# EAGLE design TrinketBlinkM0D (EAGLE 8.4.3)
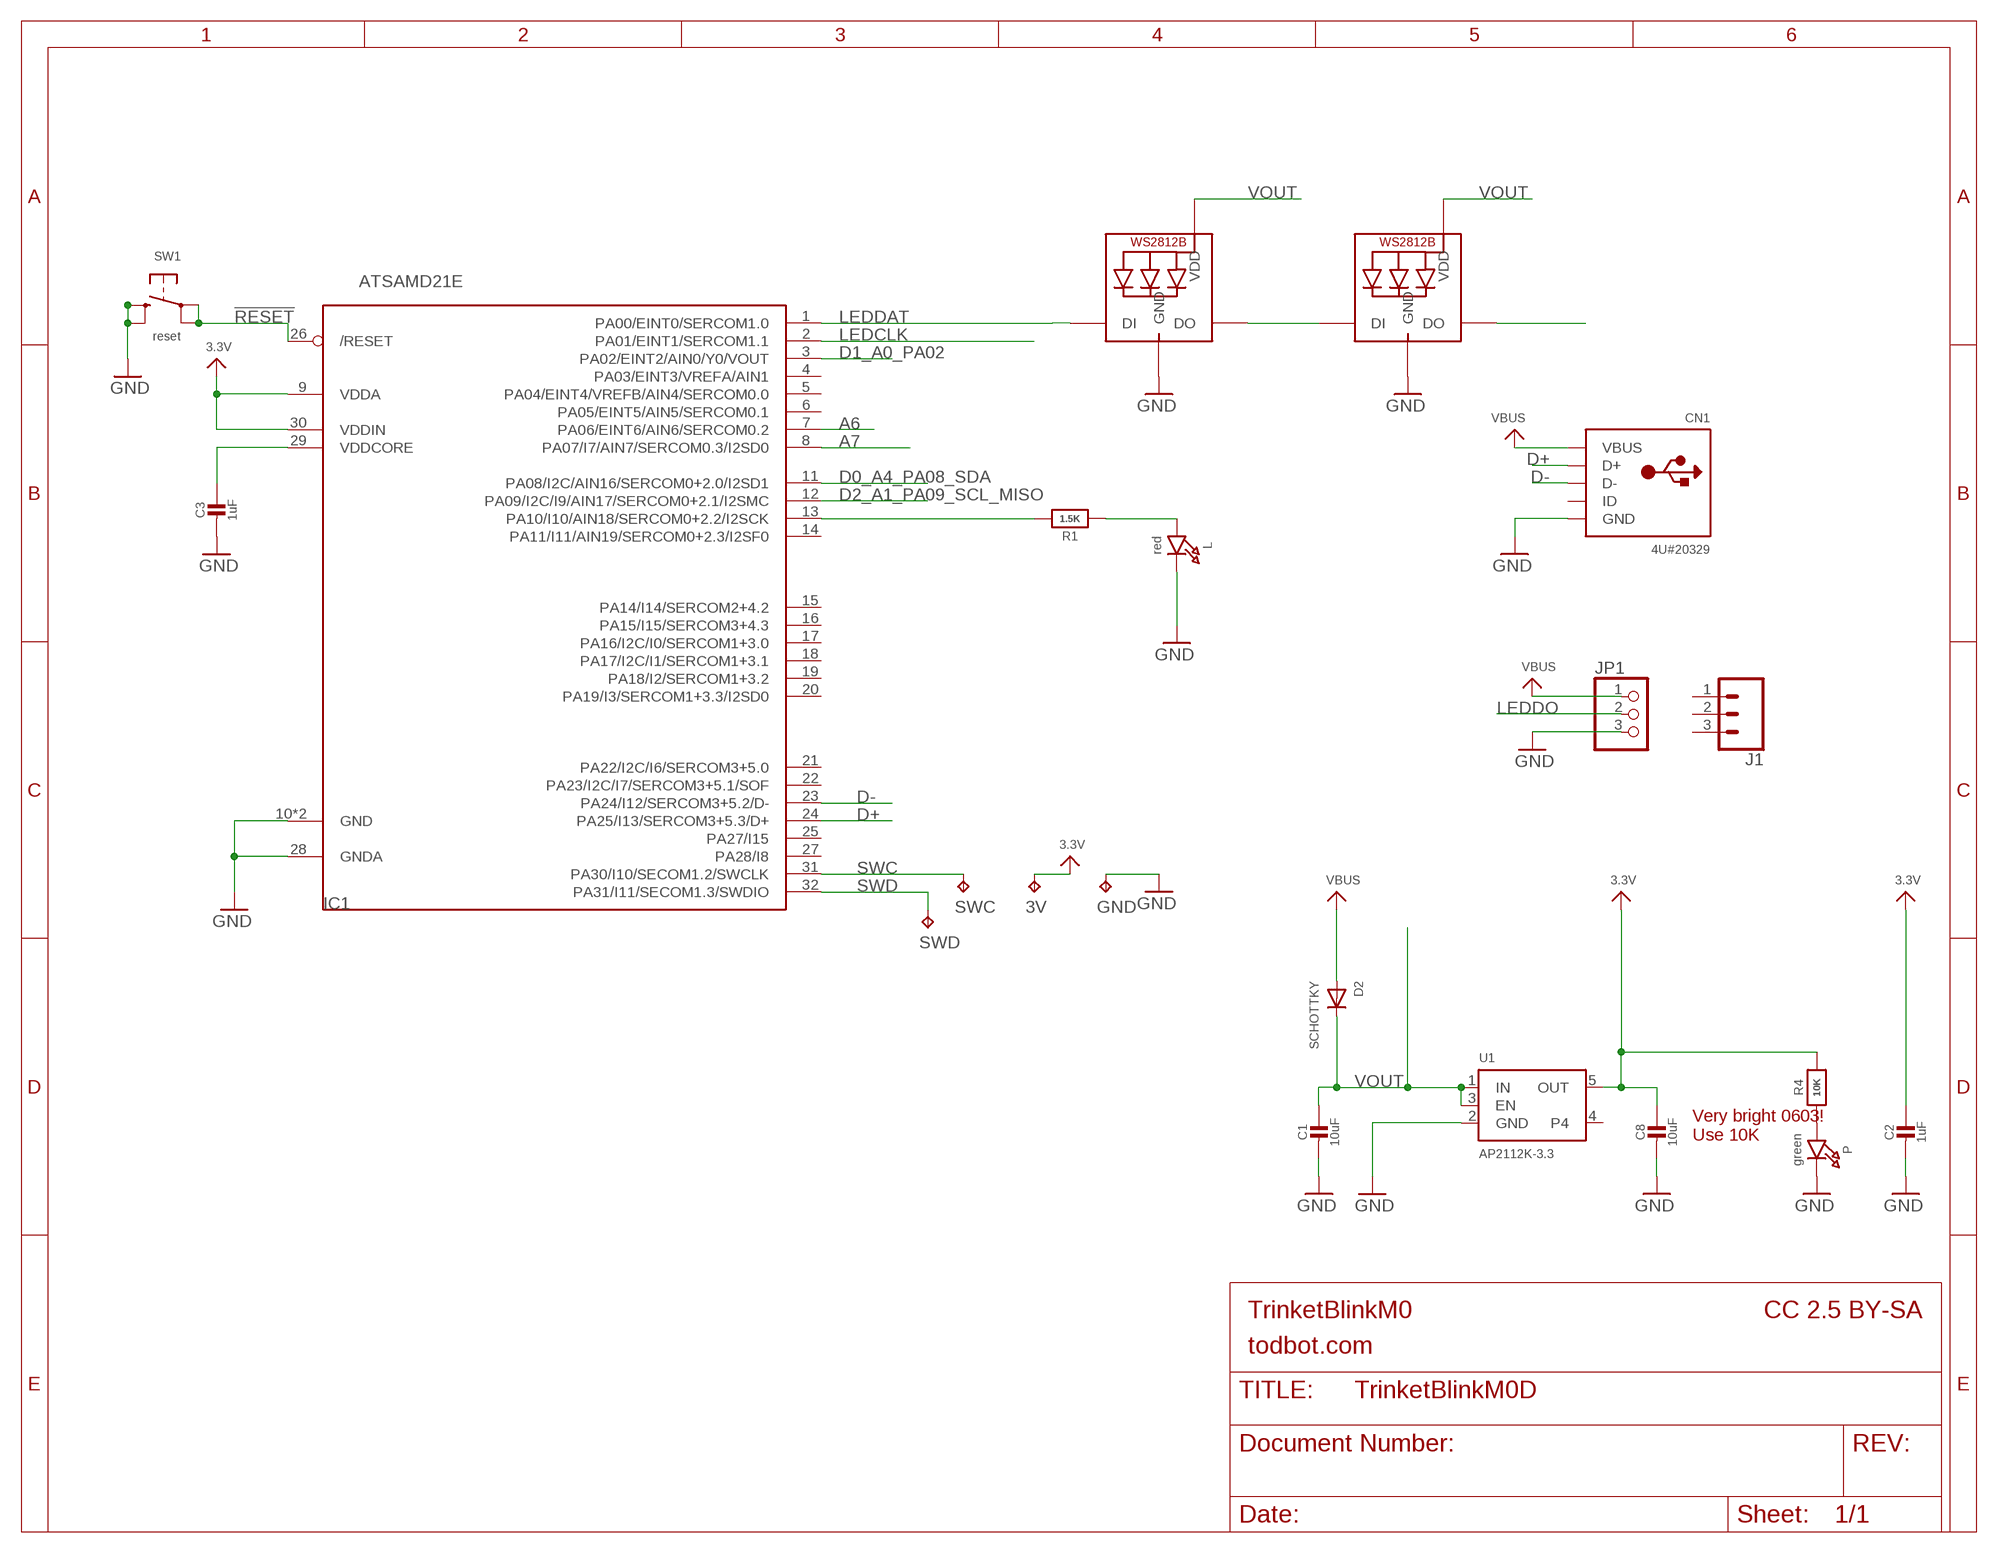
[diagram p0: schematic, sheet 1]

## Parts
3V  TPB1,27  [B1,27]
C1  10uF  CAP_CERAMIC0805-NOOUTLINE  [0805-NO]
C2  1uF  CAP_CERAMIC0603_NO  [0603-NO]
C3  1uF  CAP_CERAMIC0603_NO  [0603-NO]
C8  10uF  CAP_CERAMIC0805-NOOUTLINE  [0805-NO]
CN1  4U#20329  USB_MICRO_20329_V2  [4UCONN_20329_V2]
D2  SCHOTTKY  DIODE_SOD-123FL  [SOD-123FL]
GND  TPB1,27  [B1,27]
IC1  ATSAMD21E  [QFN32_5MM]
J1  CONN_03LONGPADS  [1X03_LONGPADS]
JP1  PINHD-1X3CB  [1X03-CLEANBIG]
L  red  LED0603_NOOUTLINE  [CHIPLED_0603_NOOUTLINE]
LED1  WS2812B_5050N  [WS2812B-NARROW]
LED2  WS2812B_5050N  [WS2812B-NARROW]
P  green  LED0603_NOOUTLINE  [CHIPLED_0603_NOOUTLINE]
R1  1.5K  RESISTOR_0603_NOOUT  [0603-NO]
R4  10K  RESISTOR_0603_NOOUT  [0603-NO]
SW1  reset  SWITCH_TACT_SMT4.6X2.8  [BTN_KMR2_4.6X2.8]
SWC  TPB1,27  [B1,27]
SWD  TPB1,27  [B1,27]
U1  AP2112K-3.3  VREG_SOT23-5  [SOT23-5]

## Nets
3.3V: 3V.TP C2.1 C8.1 IC1.9(VDDA) IC1.30(VDDIN) R4.2 U1.5(OUT)
!RESET: IC1.26(/RESET) SW1.A'(P1) SW1.A(P)
A6: IC1.7(PA06/EINT6/AIN6/SERCOM0.2)
A7: IC1.8(PA07/I7/AIN7/SERCOM0.3/I2SD0)
D0_A4_PA08_SDA: IC1.11(PA08/I2C/AIN16/SERCOM0+2.0/I2SD1)
D1_A0_PA02: IC1.3(PA02/EINT2/AIN0/Y0/VOUT)
D2_A1_PA09_SCL_MISO: IC1.12(PA09/I2C/I9/AIN17/SERCOM0+2.1/I2SMC)
D+: CN1.D+ IC1.24(PA25/I13/SERCOM3+5.3/D+)
D-: CN1.D- IC1.23(PA24/I12/SERCOM3+5.2/D-)
GND: C1.2 C2.2 C3.2 C8.2 CN1.BASE@1(GND) CN1.BASE@2(GND) CN1.GND CN1.SPRT@1(GND) CN1.SPRT@2(GND) CN1.SPRT@3(GND) CN1.SPRT@4(GND) GND.TP IC1.10(GND) IC1.28(GNDA) IC1.33(GND) JP1.3 L.C LED1.3-GND(GND) LED2.3-GND(GND) P.C SW1.B'(S1) SW1.B(S) U1.2(GND)
LEDCLK: IC1.2(PA01/EINT1/SERCOM1.1)
LEDDAT: IC1.1(PA00/EINT0/SERCOM1.0) LED1.4-DIN(DI)
LEDDO: JP1.2 LED2.2-DOUT(DO)
N$1: L.A R1.1
N$2: IC1.13(PA10/I10/AIN18/SERCOM0+2.2/I2SCK) R1.2
N$3: LED1.2-DOUT(DO) LED2.4-DIN(DI)
N$6: P.A R4.1
SWC: IC1.31(PA30/I10/SECOM1.2/SWCLK) SWC.TP
SWD: IC1.32(PA31/I11/SECOM1.3/SWDIO) SWD.TP
VBUS: CN1.VBUS D2.A JP1.1
VDDCORE: C3.1 IC1.29(VDDCORE)
VOUT: C1.1 D2.C LED1.1-VDD(VDD) LED2.1-VDD(VDD) U1.1(IN) U1.3(EN)
Unconnected: CN1.ID IC1.4(PA03/EINT3/VREFA/AIN1) IC1.5(PA04/EINT4/VREFB/AIN4/SERCOM0.0) IC1.6(PA05/EINT5/AIN5/SERCOM0.1) IC1.14(PA11/I11/AIN19/SERCOM0+2.3/I2SF0) IC1.15(PA14/I14/SERCOM2+4.2) IC1.16(PA15/I15/SERCOM3+4.3) IC1.17(PA16/I2C/I0/SERCOM1+3.0) IC1.18(PA17/I2C/I1/SERCOM1+3.1) IC1.19(PA18/I2/SERCOM1+3.2) IC1.20(PA19/I3/SERCOM1+3.3/I2SD0) IC1.21(PA22/I2C/I6/SERCOM3+5.0) IC1.22(PA23/I2C/I7/SERCOM3+5.1/SOF) IC1.25(PA27/I15) IC1.27(PA28/I8) J1.1 J1.2 J1.3 U1.4

## Notes on the sheet
- Very bright 0603!
  Use 10K
- TrinketBlinkM0 | CC 2.5 BY-SA
- todbot.com

## Library data of the parts
3V GND SWC SWD = testpad:TP: Test pad
C1-C3 C8 = microbuilder:CAP_CERAMIC: Ceramic Capacitors For new designs, use the packages preceded by an '_' character since they are more reliable: The following footprints should be used on most boards: _0402 - Standard footprint for regular board layouts _0603 - Standard footprint for regular board layouts _0805 - Standard footprint for regular board layouts _1206 - Standard footprint for regular board layouts For extremely tight-pitch boards where space is at a premium, the following 'micro-pitch' footprints can be used (smaller pads, no silkscreen outline, etc.): _0402MP - Micro-pitch footprint for very dense/compact boards _0603MP - Micro-pitch footprint for very dense/compact boards _0805MP - Micro-pitch footprint for very dense/compact boards _1206MP - Micro-pitch footprint for very dense/compact boards
CN1 = microbuilder:USB: USB Connectors USBMINIB - Surface Mount Female Mini-B USB Connector 4UConnector: 06564
D2 = adafruit:DIODE: Diode SMADIODE - SMA Surface Mount Package 20V 1A Schottky Diode Digikey: 641-1014-6-ND DO-1N4148 - Through Hole Small Current Diode SOD-123 20V 1 A (.5mV Vf) Schottky Diode - Digikey: MBRX120TPMSCT-ND SOD-323 10V 570mA (.38mV Vf, 3ns) Schottky Diode - Digikey: ZLLS410CT-ND SOD-523 30V 30mA Schottky Diode (RB751S-40TE61) - Digikey: RB751S-40TE61CT-ND SOT23-R/W - SOT23 Package (R = Solder Paste/Reflow Ovens, W = Hand-Soldering) BAT54Film 40V 300mA - Digikey: 497-7162-1-ND
IC1 = microbuilder:ATSAMD21E
J1 = SparkFun-Connectors:CONN_03: Multi connection point. Often used as Generic Header-pin footprint for 0.1 inch spaced/style header connections On any of the 0.1 inch spaced packages, you can populate with these: Break Away Headers - Straight <https://www.sparkfun.com/products/116> (PRT-00116) Break Away Male Headers - Right Angle <https://www.sparkfun.com/products/553> (PRT-00553) Female Headers <https://www.sparkfun.com/products/115> (PRT-00115) Break Away Headers - Machine Pin <https://www.sparkfun.com/products/117> (PRT-00117) Break Away Female Headers - Swiss Machine Pin <https://www.sparkfun.com/products/743> (PRT-00743) Stackable Header - 3 Pin (Female, 0.1") <https://www.sparkfun.com/products/13875> (PRT-13875) For SCREWTERMINALS and SPRING TERMINALS visit here: Screw Terimnals on SparkFun.com <https://www.sparkfun.com/search/results?term=Screw+Terminals> (5mm/3.5mm/2.54mm spacing) This device is also useful as a general connection point to wire up your design to another part of your project. Our various solder wires solder well into these plated through hole pads. Hook-Up Wire - Assortment (Stranded, 22 AWG) <https://www.sparkfun.com/products/11375> (PRT-11375) Hook-Up Wire - Assortment (Solid Core, 22 AWG) <https://www.sparkfun.com/products/11367> (PRT-11367) View the entire wire category on our website here <https://www.sparkfun.com/categories/141> Special notes: Molex polarized connector foot print use with SKU : PRT-08232 with associated crimp pins and housings.
JP1 = adafruit:PINHD-1X3: PIN HEADER
L P = microbuilder:LED: LED 0603 - 0603 Surface Mount Package 2mA: Green LED - Low Power (3.9mcd, 2ma, 1.7Vf) - Digikey: 475-2709-2-ND Orange LED - Low Power (9.8mcd, 2ma, 1.8Vf) - Digikey: 475-1194-2-ND Red LED - Low Power (5mcd, 2ma, 1.8Vf) - Digikey: 475-1195-2-ND Yellow LED - Low Power (7mcd, 2ma, 1.8Vf) - Digikey: 475-1196-2-ND 5mA: Blue LED - Low Power (17mcd, 5ma, 2.9Vf) - Digikey: LNJ937W8CRACT-ND 0805 - 0805 Surface Mount Package 2mA: Red LED (8.8mcd, 2mA, 1.8Vf, Clear) - Low Power [Digikey: 475-2510-1-ND] Green LED (5mcd, 2mA, 1.8Vf, Clear) - Low Power [Digikey: 475-2730-1-ND] Yellow LED (11.3mcd, 2mA, 1.8Vf, Clear) - Low Power [Digikey: 475-2555-1-ND] 20mA: Red LED (104mcd, 20mA, Diffused) - LS R976 [Digikey: 475-1278-6-ND] Red LED (12mcd, 20mA, 2.0Vf, Clear) - APT2012EC [Digikey: 754-1128-1-ND] Green LED (15mcd, 20mA, 2.2Vf, Clear) - APT2012GC [Digikey: 754-1131-1-ND] Orange LED (160mcd, 20mA, 2.1Vf, Clear) - APT2012SECK [Digikey: 754-1130-1-ND] 1206 - 1206 Surface Mount Package Green LED (26mcd, 20mA, Diffused) - LG N971 [Digikey: 475-1407-6-ND] Red LED (15mcd, 20mA, Diffused) - LH N974 [Digikey: 475-1416-6-ND] Cree - Cree High-Power Surface Mount LEDs XPEBWT-L1-0000-00D50 - White 111lm 350mA 2.9Vf 6200K 110° XTEAWT-00-0000-00000LEE3 - White 114lm 350mA 2.85Vf 5000K 115° Everlight - Everlight 45-21 Series Surface Mount LEDs 45-21/QK2C-B2832AC2CB2/2T - Warm White 2000mcd 20mA 3.25Vf 3050K 120° 45-21/LK2C-B38452C4CB2/2T - Nuetral White 2000mcd 20mA 3.25Vf 4150K 120° 45-21/LK2C-B50634C6CB2/2T - Cold White 2200mcd 20mA 3.25Vf 5650K 120° PLCC2 Reverse Mount LS T77K-J1L2-1-0-2-R18-Z - Red 11.25mcd 2mA 1.8Vf 630nm 120° LO T77K-L1M2-24-Z - Orange 19.6mcd 2mA 1.8Vf 606nm 120° LY T77K-K2M1-26-Z - Yellow 15.7mcd 2mA 1.8Vf 587nm 120°
LED1 LED2 = adafruit:WS2812B
R1 R4 = microbuilder:RESISTOR: Resistors For new designs, use the packages preceded by an '_' character since they are more reliable: The following footprints should be used on most boards: _0402 - Standard footprint for regular board layouts _0603 - Standard footprint for regular board layouts _0805 - Standard footprint for regular board layouts _1206 - Standard footprint for regular board layouts For extremely tight-pitch boards where space is at a premium, the following 'micro-pitch' footprints can be used (smaller pads, no silkscreen outline, etc.): _0402MP - Micro-pitch footprint for very dense/compact boards _0603MP - Micro-pitch footprint for very dense/compact boards _0805MP - Micro-pitch footprint for very dense/compact boards _1206MP - Micro-pitch footprint for very dense/compact boards
SW1 = microbuilder:SWITCH_TACT_SMT: SMT Tact Switches 6x6mm - Digikey: P12940SCT-ND KMR2 (4.6x2.8mm) - Digikey: 401-1426-1-ND EVQ-PQHB55 - Light Touch, 160GF (4.5x4.5mm) - Digikey: P8090SCT-ND KMT0 - KMT021 NGJ LHS (etc.) IP68/Waterproof - Digikey: CKN10289CT-ND
U1 = microbuilder:VREG_SOT23-5: SOT23-5 Fixed Voltage Regulators Part Current Out V Out V In V Dropout θJA (°C/W) TJ (°C) Digikey Part No. ADP121 150mA 3.3V 3.4-5.5V 0.09V @ 150mA -- -- ADP121-AUJZ33R7CT-ND ADP121 150mA 3.0V 3.1-5.5V 0.09V @ 150mA -- -- ADP121-AUJZ30R7CT-ND ADP122 300mA 3.3V 3.4-5.5V 0.085V @ 300mA -- -- ADP122AUJZ-3.3-R7CT-ND ADP1712 300mA 3.3V 3.5-5.5V 0.17V @ 300mA -- -- ADP1712AUJZ-3.3-R7TR-ND AP7311 (Low Cost) 150mA 3.3V 3.5-6V 0.15V @ 150mA -- -- AP7311-33WG-7DICT-ND LD39015M18R 150mA 1.8V 1.9V-5.5V 0.08V @ 100mA -- -- 497-6977-1-ND LP2985A-33DBVR 150mA 3.3V 3.3-16V 0.28V @ 150mA 206 150 296-18479-1-ND MCP1824T-3302E/OT 300mA 3.3V 3.5V-6V 0.2V @ 300mA -- -- MCP1824T-3302E/OTCT-ND MIC5205-2.5YM5 TR 150mA 2.5V 2.7-16V 0.165V @ 150mA -- -- 576-1257-2-ND MIC5205-3.0YM5 TR 150mA 3.0V 3.2V-16V 0.165V @ 150mA -- -- 576-1258-2-ND MIC5205-3.3YM5 TR 150mA 3.3V 3.5V-16V 0.165V @ 150mA -- -- 576-1259-2-ND TPS780330220 150mA 3.3V+2.2V 3.6-5.5V 250mV Max -- -- 296-23332-1-ND TDA3663/N1,135 100mA 3.3V 3.5-45V 0.18V @ 50mA -- -- 568-5343-1-ND Max operating temp can be calculated using θJA, TJ (max junction temperature), and power in watts. Set the "Maximum Ambient Temperature" until it reaches TJ ("Max Junction Temperature"), which is the absolute limit for safe use of the regulator: Heat Sink Temperature Calculator <http://www.daycounter.com/Calculators/Heat-Sink-Temperature-Calculator.phtml> For example, With 12V source into a 3.3V LP2985 and a 30mA load, we are dissipating (12V-3.3V) * 0.03A = 0.261W. With a θJA of 206 °C/W, a TJ of 150°C, and 261mW we can safely use the chip without a heat sink up to 75°C (=147.1°C Junction Temperature).

## Net classes
1 power: width 0.305 mm

## Board
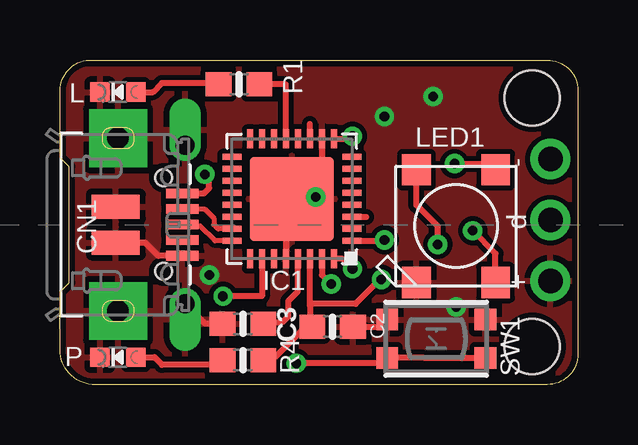
[diagram p1: board, top side]
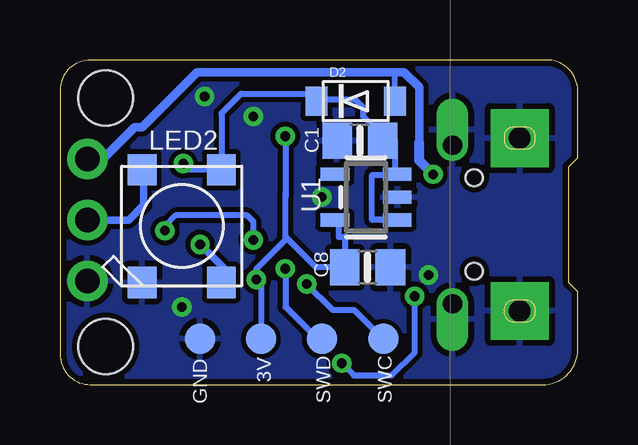
[diagram p2: board, bottom side, seen from below]

Size 21.6 x 13.53 mm. Coordinates in mm from the lower left corner, seen from the top.
Outline: 1.21,13.53 19.25,13.53 20.33,13.53 arc-90 21.6,12.26 21.6,1.27 arc-90 20.33,0 19.88,0 1.34,0 arc-90 0.01,1.59 0.01,3.87 0.39,4.25 0.39,9.08 0.01,9.46 0.01,12.13 arc-90 1.21,13.53
Copper layers (1*16): Top 0.035mm / dielectric 1.5mm / Bottom 0.035mm
Design rules "adafruit *": minimum track width 8mil, minimum drill 15.5mil, track to track 8mil, track to pad 8mil, pad to pad 8mil, via to via 8mil, smd to smd 8mil, copper to edge 10mil, drill to drill 8mil, minimum pad ring 10mil, minimum via ring 8mil, stop-mask expansion 2mil, vias tented up to drill 20mil, thermal gap 10mil
Holes 2.29 mm at 19.69,1.59 19.69,11.94

### Footprints (pad centres in the part's own frame; a part is rotated, then mirrored left to right if it is on the bottom)
B1,27 = smd 1.27 x 1.27: TP 0,0
0805-NO = smd 1.24 x 1.5: 1 -0.95,0; 2 0.95,0
0603-NO = smd 1.075 x 1: 1 -0.85,0; 2 0.85,0
4UCONN_20329_V2 = smd 1 x 2: BASE@1 -0.75,-2; BASE@2 0.75,-2 | smd 0.4 x 1.35: D+ 0,0.775; D- -0.65,0.775; GND 1.3,0.775; ID 0.65,0.775; VBUS -1.3,0.775 | drill 0.8 pad 1.143 offset: SPRT@1 -3.3,0.9; SPRT@2 3.3,0.9 | drill 0.9 pad 2.413 square: SPRT@3 -3.6,-1.9; SPRT@4 3.6,-1.9 | hole 0.7: -1.95,0; 1.95,0
SOD-123FL = smd 0.91 x 1.22: A 1.637,0; C -1.637,0
QFN32_5MM = smd 0.8 x 0.25: 1 -2.5,1.75; 2 -2.5,1.25; 3 -2.5,0.75; 4 -2.5,0.25; 5 -2.5,-0.25; 6 -2.5,-0.75; 7 -2.5,-1.25; 8 -2.5,-1.75; 17 2.5,-1.75; 18 2.5,-1.25; 19 2.5,-0.75; 20 2.5,-0.25; 21 2.5,0.25; 22 2.5,0.75; 23 2.5,1.25; 24 2.5,1.75 | smd 0.25 x 0.8: 9 -1.75,-2.5; 10 -1.25,-2.5; 11 -0.75,-2.5; 12 -0.25,-2.5; 13 0.25,-2.5; 14 0.75,-2.5; 15 1.25,-2.5; 16 1.75,-2.5; 25 1.75,2.5; 26 1.25,2.5; 27 0.75,2.5; 28 0.25,2.5; 29 -0.25,2.5; 30 -0.75,2.5; 31 -1.25,2.5; 32 -1.75,2.5 | smd 3.5 x 3.5: 33 0,0
1X03_LONGPADS = drill 1.118 pad 1.88 long: 1 0,0; 2 2.54,0; 3 5.08,0
1X03-CLEANBIG = drill 1.016 pad 1.676: 1 -2.54,0; 2 0,0; 3 2.54,0
CHIPLED_0603_NOOUTLINE = smd 0.8 x 0.8: A 0,-0.75; C 0,0.75
WS2812B-NARROW = smd 1.3 x 1.2: 1-VDD 2.35,-1.65; 2-DOUT 2.35,1.65; 3-GND -2.35,1.65; 4-DIN -2.35,-1.65
BTN_KMR2_4.6X2.8 = smd 0.9 x 0.9: A 2.05,0.8; A' -2.05,0.8; B 2.05,-0.8; B' -2.05,-0.8
SOT23-5 = smd 0.55 x 1.2: 1 -0.95,-1.3; 2 0,-1.3; 3 0.95,-1.3; 4 0.95,1.3; 5 -0.95,1.3

### Placement (x,y rotation side)
3V  13.21,1.91 270 bottom
C1  9.09,10.16 180 bottom
C2  11.37,2.41 0 top
C3  7.63,2.54 180 top
C8  8.77,4.89 0 bottom
CN1  4.32,6.67 270 top
D2  9.26,11.81 0 bottom
GND  15.75,1.91 270 bottom
IC1  9.67,7.74 180 top
J1  -0.19,-18.41 0 top  (outside the outline)
JP1  20.45,6.86 270 top
L  2.42,12.19 90 top
LED1  16.52,6.6 90 top
LED2  16.52,6.6 90 bottom
P  2.42,1.14 90 top
R1  7.46,12.51 0 top
R4  7.63,1.02 0 top
SW1  15.69,1.91 180 top
SWC  8.11,1.91 270 bottom
SWD  10.67,1.91 270 bottom
U1  8.83,7.81 90 bottom
U$1  [TRINKET_M0_BOTTOM]  21.6,14.29 270 bottom
U$20  [TRINKET_M0_TOP]  21.6,-0.95 90 top

### Tracks (layer width: path | path; a pad name or v marks a point on that pad's centre or on a via)
3.3V  (via drill 0.4)
  Top 0.254: IC1.9 12.09,10.24 v12.2,10.35 | 10.42,3.3 10.42,2.61 | 10.42,3.3 IC1.30 | 10.42,2.61 8.96,1.14 8.48,1.14 R4.2 | 10.52,2.64 C2.1 10.42,2.51 10.42,2.61 | v13.4,4.38 13.34,4.38 12.32,3.37 10.49,3.37 10.42,3.3
  Bottom 0.254: v12.2,10.35 12.2,8 | 12.2,8 12.2,7.81 | 12.2,6.22 12.2,8 | 12.2,6.16 12.2,6.03 | 12.2,6.16 12.2,6.22 | 12.2,6.22 12.2,6.16 | 12.2,6.16 12.2,6.03 | 12.2,6.03 13.4,4.83 v13.4,4.38 13.21,4.19 3V.TP | 12.2,6.16 12.2,6.03 | 9.98,6.16 9.72,6.16 C8.1 10.93,4.89 12.2,6.16 | 9.98,6.16 | 9.98,6.16 | U1.5 9.98,6.7 9.98,6.16
!RESET  (via drill 0.4)
  Top 0.254: v9.85,0.89 13.61,0.89 13.61,1.11 SW1.A 15.18,1.11 SW1.A' | v6.8,3.68 8.42,3.68 IC1.26
  Bottom 0.254: v9.85,0.89 9.34,0.38 7.75,0.38 6.8,1.33 v6.8,3.68
D0_A4_PA08_SDA
  Top 0.254: IC1.11 10.42,10.86
D1_A0_PA02
  Top 0.254: IC1.3 12.77,6.99
D+
  Top 0.203: IC1.24 6.46,5.99 5.85,6.6 5.16,6.6
  Top 0.254: 5.16,6.6 CN1.D+
D-
  Top 0.203: CN1.D- 6.02,7.32 6.42,6.92 6.42,6.67 6.6,6.49 IC1.23
GND  (via drill 0.4)
  Top 0.254: CN1.GND 4.1,5.37 3.55,5.92 CN1.BASE@2 | IC1.28 9.42,7.49 arc-90 IC1.33 10.67,7.74 | IC1.10 10.92,7.81 | 3.17,2.32 CN1.SPRT@4 | 10.73,7.81 v10.67,7.81 10.61,7.81 | C3.2 6.05,2.54 CN1.SPRT@2 | C2.2 13.64,2.41 SW1.B
  Bottom 0.254: CN1.SPRT@2 5.22,1.73
  other vias: 15.56,12 16.52,3.24 6.23,4.57 13.53,11.18
  pour Bottom: 0.01,-0.95 21.6,-0.95 21.6,14.29 0.01,14.29
  pour Top: -0.19,-1.4 21.4,-1.4 21.53,15.11 -0.06,15.11
LEDDAT  (via drill 0.4)
  Top 0.254: v13.53,6.03 13.53,5.99 IC1.1 | LED1.4-DIN 18.17,5.46 v17.21,6.41
  Bottom 0.254: v13.53,6.03 13.53,6.79 13.72,6.99 13.79,7.05 16.77,7.05 17.21,6.6 v17.21,6.41
LEDDO
  Bottom 0.254: 18.1,8.89 18.1,8.95 LED2.2-DOUT
  Bottom 0.305: JP1.2 18.74,6.86 18.1,7.49 18.1,8.89
N$1
  Top 0.254: L.A 3.88,12.19 4.26,12.57 5.59,12.57 6.55,12.57 R1.1
N$2
  Top 0.254: IC1.13 9.42,12.51 R1.2
N$3  (via drill 0.4)
  Top 0.254: v15.75,5.84 15.75,6.6 14.86,7.49 LED1.2-DOUT
  Bottom 0.254: LED2.4-DIN 14.8,4.32
  Bottom 0.305: LED2.4-DIN | v15.75,5.84 14.8,4.89 14.8,4.32
N$6
  Top 0.254: P.A 3.94,1.14 4.26,0.83 6.78,0.83 R4.1
SWC  (via drill 0.4)
  Top 0.254: IC1.31 10.92,4.58 v11.31,4.19
  Bottom 0.254: v11.31,4.19 10.23,3.11 9.34,3.11 8.13,1.91 SWC.TP
SWD  (via drill 0.4)
  Top 0.254: IC1.32 11.78,5.24 v12.2,4.83
  Bottom 0.254: v12.2,4.83 12.2,3.24 10.86,1.91 SWD.TP
VBUS  (via drill 0.4)
  Top 0.254: CN1.VBUS 6,7.97 6.23,8.19 6.23,8.57 v6.04,8.76
  Bottom 0.254: D2.A 7.63,13.02 7.37,13.02
  Bottom 0.305: 19.94,9.4 JP1.1
  Bottom 0.356: 6.1,8.76 v6.04,8.76 | 6.61,10.1 6.61,11.43 6.61,12.38 7.24,13.02 7.37,13.02 11.63,13.02 15.88,13.02 18.17,10.73 18.36,10.73 18.48,10.73 19.82,9.4
  Bottom 0.406: JP1.1 19.82,9.4 | v6.04,8.76 6.61,9.34 6.61,10.1
VDDCORE
  Top 0.254: C3.1 8.48,2.6 9.28,2.6 9.53,2.86 9.53,3.49 9.92,3.88 IC1.29
VOUT  (via drill 0.4)
  Top 0.254: v16.45,9.21 18.17,9.21 LED1.1-VDD
  Bottom 0.254: v16.45,9.21 16.2,8.95 LED2.1-VDD 14.87,11.3 14.04,12.13 10.9,12.13 D2.C | 7.63,8.73 8.58,8.73 8.58,6.86 8.19,6.86 U1.1 | 7.63,10.16 | 7.63,10.16 7.63,8.73 | 10.48,11.89 9.29,11.89 8.96,11.56 8.96,11.18 8.14,10.35 C1.1 | 10.79,11.89 10.48,11.89 | 10.84,11.89 10.79,11.89 | 10.79,11.89 10.48,11.89 | U1.3 7.6,8.76 7.63,8.73 | 7.63,10.16 C1.1 | C1.1 8.13,10.29
  Bottom 0.356: D2.C 10.82,11.89 10.79,11.89

### Text on the board
tPlace: - | d | +